# Altium schematic sheet A3-USB.SchDoc
size A
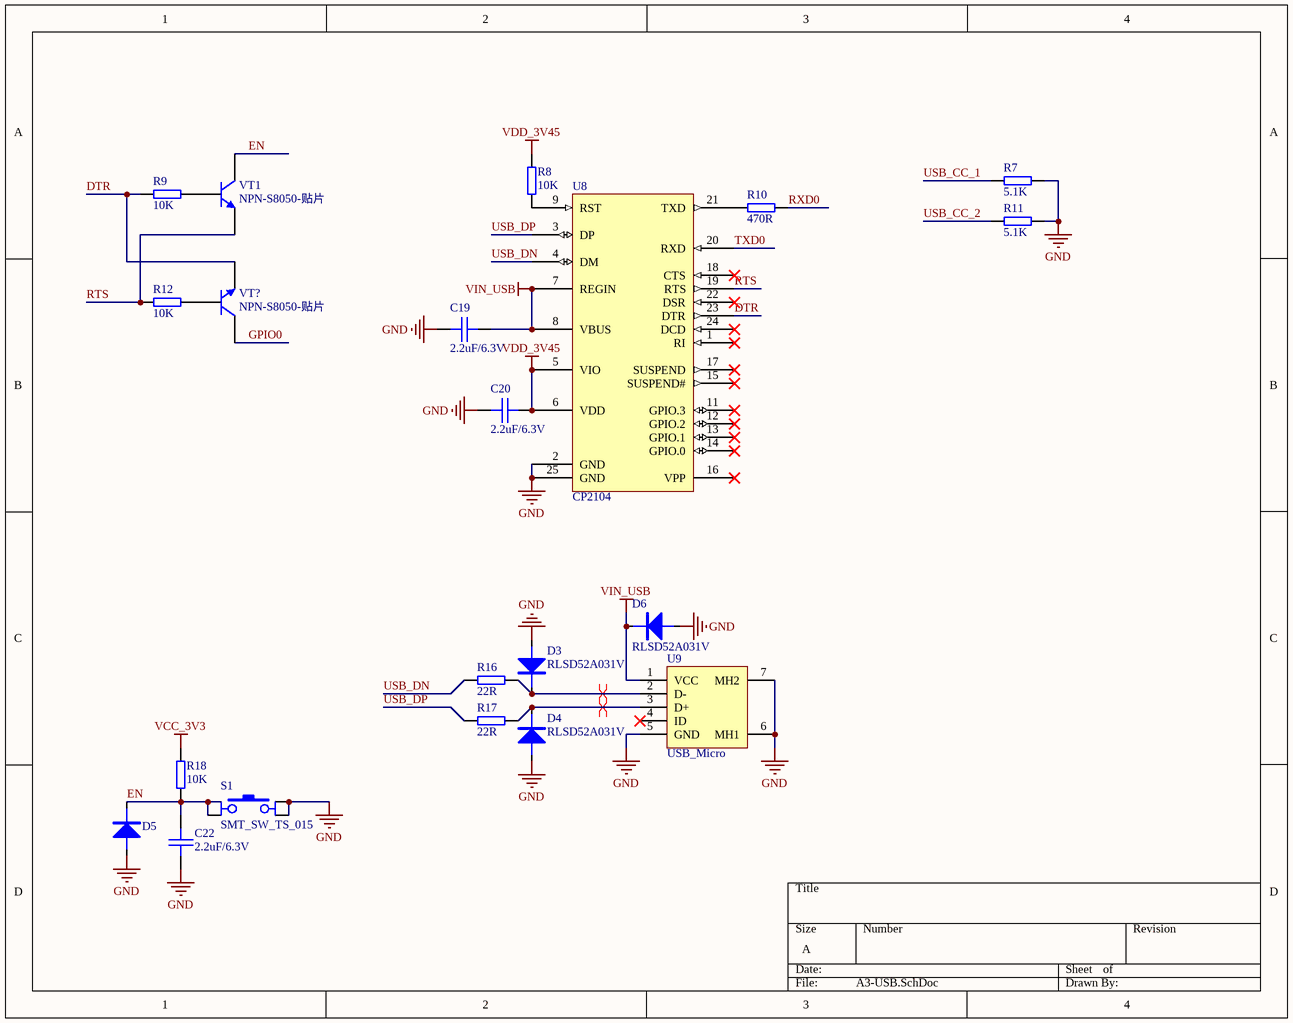
[diagram p0: A3-USB.SchDoc]

## Parts
C19  2.2uF/6.3V  [SMT_C_0402]
C20  2.2uF/6.3V  [SMT_C_0402]
C22  2.2uF/6.3V  [SMT_C_0402]
D3  RLSD52A031V  [SMT_DIODE_SOD_523]
D4  RLSD52A031V  [SMT_DIODE_SOD_523]
D5  RLSD52A031V  [SMT_DIODE_SOD_523]  (value not drawn)
D6  RLSD52A031V  [SMT_DIODE_SOD_523]
R7  5.1K  [SMT_R_0402]
R8  10K  [SMT_R_0402]
R9  10K  [SMT_R_0402]
R10  470R  [SMT_R_0402]
R11  5.1K  [SMT_R_0402]
R12  10K  [SMT_R_0402]
R16  22R  [SMT_R_0402]
R17  22R  [SMT_R_0402]
R18  10K  [SMT_R_0402]
S1  SMT_SW_TS_015  [SMT_SW_TS_015]
U8  CP2104  [PQFN50P400X400X80_HS-25N]
U9  USB_Micro  [M5-USB-TC-2]
VT1  NPN-S8050-贴片  [NPN-S8050-贴片]
VT?  NPN-S8050-贴片  [NPN-S8050-贴片]

## Nets
GND: C19.1 C20.1 C22.1 D3.1(A) D4.1(A) D5.1(A) D6.1(A) R7.1 R11.1 S1.3(PINB1) S1.4(PINB2) U8.2(GND) U8.25(GND) U9.5(GND) U9.6(MH1) U9.7(MH2)
VCC_3V3: R18.2
VDD_3V45: C20.2 R8.1 U8.5(VIO) U8.6(VDD)
VIN_USB: C19.2 D6.2(K) U8.7(REGIN) U8.8(VBUS) U9.1(VCC)
DTR: R9.2 U8.23(DTR) VT?.2(E)
EN: C22.2 D5.2(K) R18.1 S1.1(PINA1) S1.2(PINA2) VT1.3(C)
GPIO0: VT?.3(C)
RTS: R12.2 U8.19(RTS) VT1.2(E)
RXD0: R10.1
TXD0: U8.20(RXD)
USB_CC_1: R7.2
USB_CC_2: R11.2
USB_DN: R16.2 U8.4(DM)
USB_DP: R17.2 U8.3(DP)
NetD3_2: D3.2(K) R16.1 U9.2(D-)
NetD4_2: D4.2(K) R17.1 U9.3(D+)
NetR8_2: R8.2 U8.9(RST)
NetR9_1: R9.1 VT1.1(B)
NetR10_2: R10.2 U8.21(TXD)
NetR12_1: R12.1 VT?.1(B)

Not connected (* = marked no-connect by the designer): U8 1(RI)* 11(GPIO.3)* 12(GPIO.2)* 13(GPIO.1)* 14(GPIO.0)* 15(SUSPEND#)* 16(VPP)* 17(SUSPEND)* 18(CTS)* 22(DSR)* 24(DCD)*; U9 4(ID)*

## Layout directives
differential pair: NetD3_2, NetD4_2

## Notes on the sheet
- Labels drawn without touching a wire or pin: DSR, DTR, GND

## Library data of the parts
C19 C20 C22 = SMT_C_0402: Surface mount capacitor 0402
D3-D6 = SMT_DIODE_SOD_323: Surface mount diode SOD-323(0805) Package
R7-R12 R18 = SMT_R_0402: Surface mount resistor 0402
R16 R17 = SMT_R_0603: Surface mount resistor 0603
U8 = CP2104: 单芯片USB转UART桥接器
U9 = USB_Micro: USB micro female